# Altium schematic sheet TxRx2.SchDoc
size A; SheetNumber: 1; SheetTotal: 1
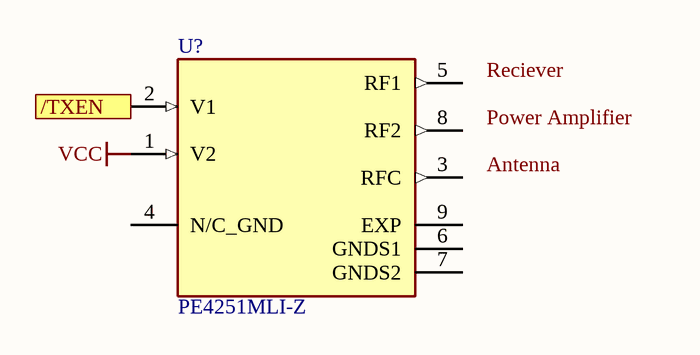
[diagram p0: TxRx2.SchDoc]

## Parts
U?  PE4251MLI-Z  [SOP65P490X106-9N]

## Ports
/TXEN (in)

## Nets
VCC: U?.1(V2)
/TXEN: U?.2(V1) ; port /TXEN

Not connected (* = marked no-connect by the designer): U? 3(RFC) 4(N/C_GND) 5(RF1) 6(GNDS1) 7(GNDS2) 8(RF2) 9(EXP)

## Notes on the sheet
- Labels drawn without touching a wire or pin: Antenna, Power Amplifier, Reciever

## Library data of the parts
U? = PE4251MLI-Z: RF Switch IC General Purpose SPDT 3 GHz 50Ohm 8-MSOP-EP; MF: pSemi; SnapEDA_Link: https://www.snapeda.com/parts/PE4251MLI-Z/pSemi/view-part/?ref=snap; Package: MSOP-8 Peregrine Semiconductor; Value: *; MP: PE4251MLI-Z; Check_prices: https://www.snapeda.com/parts/PE4251MLI-Z/pSemi/view-part/?ref=eda